# Altium schematic sheet S02-BEAGLEBONE.SchDoc
size B; SheetNumber: 3; SheetTotal: 7; BLOCK-TITLE: BEAGLEBONE BLACK HEADERS; BLOCK-SIZE: B; BLOCK-PROJECT: MULTIMOD BASE; BLOCK-REVISION: 1; BLOCK-ORGANIZATION: UNIVERSITY OF FLORIDA; BLOCK-DESIGNER: MEHRON TALEBI; BLOCK-IDENTIFIER: SUMMER 2023; BLOCK-REVIEWER: MIKE STAPLETON
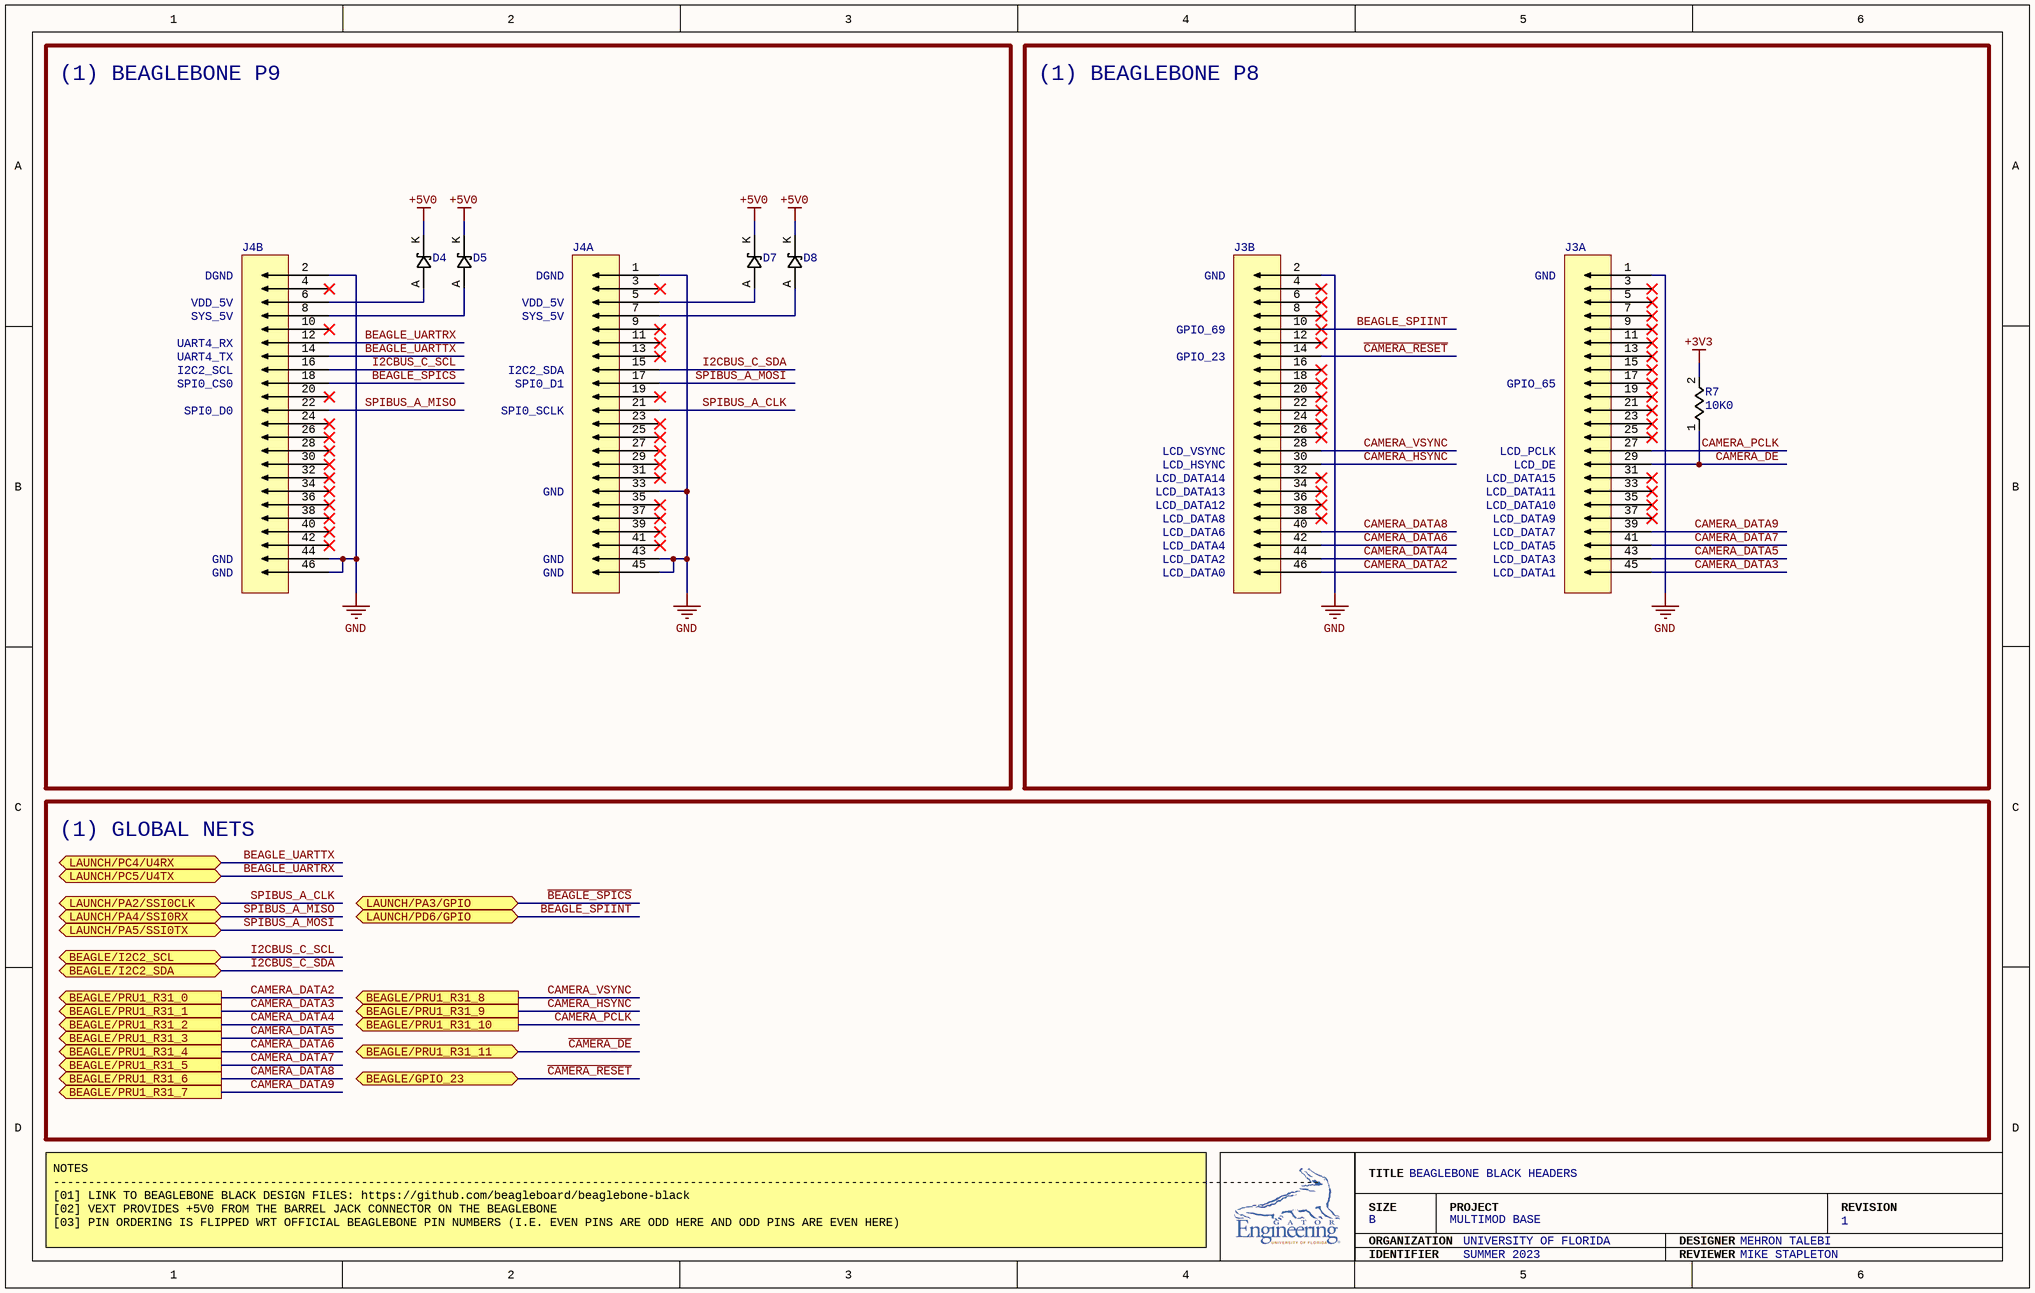
[diagram p0: S02-BEAGLEBONE.SchDoc]

## Parts
D4  RBR5L30BDDTE25  [RBR5L30BDDTE25]  (value not drawn)
D5  RBR5L30BDDTE25  [RBR5L30BDDTE25]  (value not drawn)
D7  RBR5L30BDDTE25  [RBR5L30BDDTE25]  (value not drawn)
D8  RBR5L30BDDTE25  [RBR5L30BDDTE25]  (value not drawn)
J3  95278-101-46LF  [95278-101-46LF]  (value not drawn)  (parts A,B of 2)
J4  95278-101-46LF  [95278-101-46LF]  (value not drawn)  (parts A,B of 2)
R7  10K0  [RC0805FR-0710KL]

## Blocks framed on the sheet
(1) BEAGLEBONE P9: D4 D5 D7 D8 J4
(1) BEAGLEBONE P8: J3 R7

## Ports
BEAGLE/GPIO_23 (bidir), BEAGLE/I2C2_SCL (bidir), BEAGLE/I2C2_SDA (bidir), BEAGLE/PRU1_R31_0 (out), BEAGLE/PRU1_R31_1 (out), BEAGLE/PRU1_R31_2 (out), BEAGLE/PRU1_R31_3 (out), BEAGLE/PRU1_R31_4 (out), BEAGLE/PRU1_R31_5 (out), BEAGLE/PRU1_R31_6 (out), BEAGLE/PRU1_R31_7 (out), BEAGLE/PRU1_R31_8 (out), BEAGLE/PRU1_R31_9 (out), BEAGLE/PRU1_R31_10 (out), BEAGLE/PRU1_R31_11 (bidir), LAUNCH/PA2/SSI0CLK (bidir), LAUNCH/PA3/GPIO (bidir), LAUNCH/PA4/SSI0RX (bidir), LAUNCH/PA5/SSI0TX (bidir), LAUNCH/PC4/U4RX (bidir), LAUNCH/PC5/U4TX (bidir), LAUNCH/PD6/GPIO (bidir)

## Nets
+3V3: R7.2
+5V0: D4.K(+) D5.K(+) D7.K(+) D8.K(+)
GND: J3.1 J3.2 J4.1 J4.2 J4.33 J4.43 J4.44 J4.45 J4.46
~{BEAGLE_SPICS}: J4.18 ; port LAUNCH/PA3/GPIO
~{CAMERA_DE}: J3.29 R7.1 ; port BEAGLE/PRU1_R31_11
~{CAMERA_RESET}: J3.14 ; port BEAGLE/GPIO_23
BEAGLE_SPIINT: J3.10 ; port LAUNCH/PD6/GPIO
BEAGLE_UARTRX: J4.12 ; port LAUNCH/PC5/U4TX
BEAGLE_UARTTX: J4.14 ; port LAUNCH/PC4/U4RX
CAMERA_DATA2: J3.46 ; port BEAGLE/PRU1_R31_0
CAMERA_DATA3: J3.45 ; port BEAGLE/PRU1_R31_1
CAMERA_DATA4: J3.44 ; port BEAGLE/PRU1_R31_2
CAMERA_DATA5: J3.43 ; port BEAGLE/PRU1_R31_3
CAMERA_DATA6: J3.42 ; port BEAGLE/PRU1_R31_4
CAMERA_DATA7: J3.41 ; port BEAGLE/PRU1_R31_5
CAMERA_DATA8: J3.40 ; port BEAGLE/PRU1_R31_6
CAMERA_DATA9: J3.39 ; port BEAGLE/PRU1_R31_7
CAMERA_HSYNC: J3.30 ; port BEAGLE/PRU1_R31_9
CAMERA_PCLK: J3.27 ; port BEAGLE/PRU1_R31_10
CAMERA_VSYNC: J3.28 ; port BEAGLE/PRU1_R31_8
I2CBUS_C_SCL: J4.16 ; port BEAGLE/I2C2_SCL
I2CBUS_C_SDA: J4.15 ; port BEAGLE/I2C2_SDA
SPIBUS_A_CLK: J4.21 ; port LAUNCH/PA2/SSI0CLK
SPIBUS_A_MISO: J4.22 ; port LAUNCH/PA4/SSI0RX
SPIBUS_A_MOSI: J4.17 ; port LAUNCH/PA5/SSI0TX
NetD4_A: D4.A(-) J4.6
NetD5_A: D5.A(-) J4.8
NetD7_A: D7.A(-) J4.5
NetD8_A: D8.A(-) J4.7

Not connected (* = marked no-connect by the designer): J3 3* 4* 5* 6* 7* 8* 9* 11* 12* 13* 15* 16* 17* 18* 19* 20* 21* 22* 23* 24* 25* 26* 31* 32* 33* 34* 35* 36* 37* 38*; J4 3* 4* 9* 10* 11* 13* 19* 20* 23* 24* 25* 26* 27* 28* 29* 30* 31* 32* 34* 35* 36* 37* 38* 39* 40* 41* 42*

## Notes on the sheet
- DGND
- VDD_5V
- GND
- SYS_5V
- I2C2_SCL
- UART4_RX
- UART4_TX
- I2C2_SDA
- GPIO_23
- GPIO_69
- SPI0_CS0
- SPI0_D0
- SPI0_D1
- SPI0_SCLK
- GPIO_65
- LCD_VSYNC
- LCD_HSYNC
- LCD_DATA13
- LCD_DATA12
- LCD_DATA14
- LCD_PCLK
- LCD_DE
- LCD_DATA11
- LCD_DATA10
- LCD_DATA15
- LCD_DATA8
- LCD_DATA6
- LCD_DATA4
- LCD_DATA2
- LCD_DATA0
- LCD_DATA9
- LCD_DATA7
- LCD_DATA5
- LCD_DATA3
- LCD_DATA1
- (1) GLOBAL NETS
- NOTES
  -------------------------------------------------------------------------------------------------------------------------------------------------------------------------------------
  [01] LINK TO BEAGLEBONE BLACK DESIGN FILES: https://github.com/beagleboard/beaglebone-black
  [02] VEXT PROVIDES +5V0 FROM THE BARREL JACK CONNECTOR ON THE BEAGLEBONE
  [03] PIN ORDERING IS FLIPPED WRT OFFICIAL BEAGLEBONE PIN NUMBERS (I.E. EVEN PINS ARE ODD HERE AND ODD PINS ARE EVEN HERE)
- TITLE
- SIZE
- ORGANIZATION
- PROJECT
- DESIGNER
- REVISION
- IDENTIFIER
- REVIEWER

## Library data of the parts
D4 D5 D7 D8 = RBR5L30BDDTE25: DIODE SCHOTTKY 30V 5A PMDS; Voltage - Forward (Vf) (Max) @ If: 490 mV @ 5 A; Speed: Fast Recovery =< 500ns, > 200mA (Io); Current - Reverse Leakage @ Vr: 150 µA @ 30 V; Diode Type: Schottky; Voltage - DC Reverse (Vr) (Max): 30 V; Current - Average Rectified (Io): 5A; Mounting Type: Surface Mount; Package / Case: DO-214AC, SMA; Operating Temperature - Junction: -55°C ~ 150°C; Supplier 1: Digi-Key; Supplier Part Number 1: 846-RBR5L30BDDTE25CT-ND
J3 J4 = 95278-101-46LF: CONN HEADER SMD 46POS 2.54MM; Connector Type: Header, Breakaway; Pitch - Mating: 0.100" (2.54mm); Number of Positions: 46; Number of Positions Loaded: All; Style: Board to Board; Shrouding: Unshrouded; Contact Length - Mating: 0.232" (5.90mm); Material Flammability Rating: UL94 V-0; Current Rating (Amps): 3A per Contact; Contact Type: Male Pin; Number of Rows: 2; Row Spacing - Mating: 0.100" (2.54mm); Mounting Type: Surface Mount; Termination: Solder; Fastening Type: Push-Pull; Insulation Height: 0.100" (2.54mm); Contact Shape: Square; Contact Finish - Mating: Gold, GXT™; Contact Finish Thickness - Mating: 30.0µin (0.76µm); Contact Finish - Post: Tin; Contact Material: Phosphor Bronze; Insulation Material: Thermoplastic; Operating Temperature: -65°C ~ 125°C; Insulation Color: Black; Contact Finish Thickness - Post: 78.7µin (2.00µm); Supplier 1: Newark; Supplier Part Number 1: 17M5553
R7 = RC0805FR-0710KL: RES 10K OHM 1% 1/8W 0805; Resistance: 10 kOhms; Power (Watts): 0.125W, 1/8W; Temperature Coefficient: ±100ppm/°C; Tolerance: ±1%; Composition: Thick Film; Features: Moisture Resistant; Operating Temperature: -55°C ~ 155°C; Package / Case: 0805 (2012 Metric); Supplier Device Package: 0805; Size / Dimension: 0.079" L x 0.049" W (2.00mm x 1.25mm); Height - Seated (Max): 0.024" (0.60mm); Number of Terminations: 2; Supplier 1: Future Electronics; Supplier Part Number 1: 3310877